# EAGLE design Solenoise (EAGLE 6.5.0)
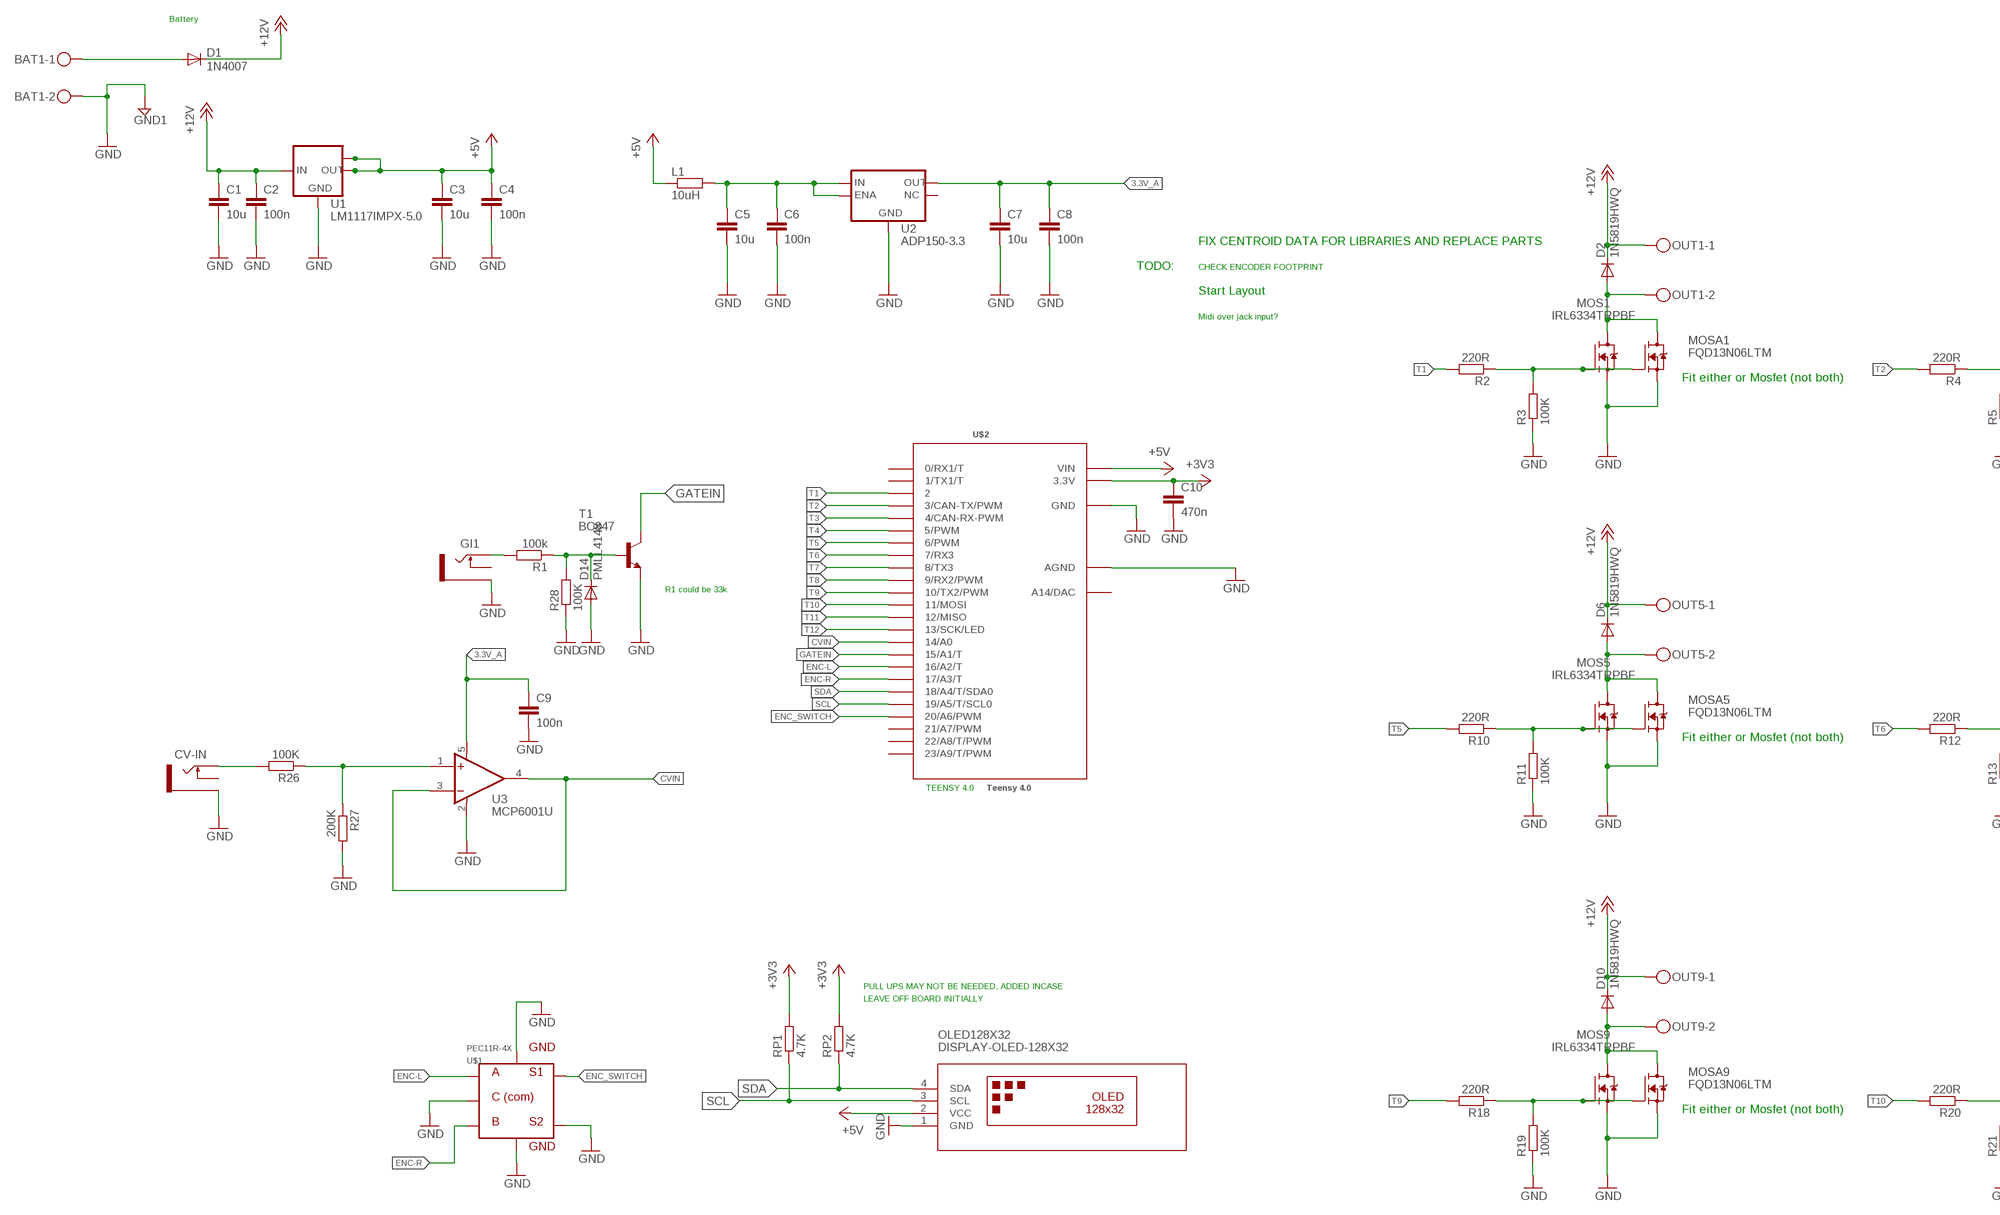
[diagram p0: schematic, sheet 1, part 1 of 2]
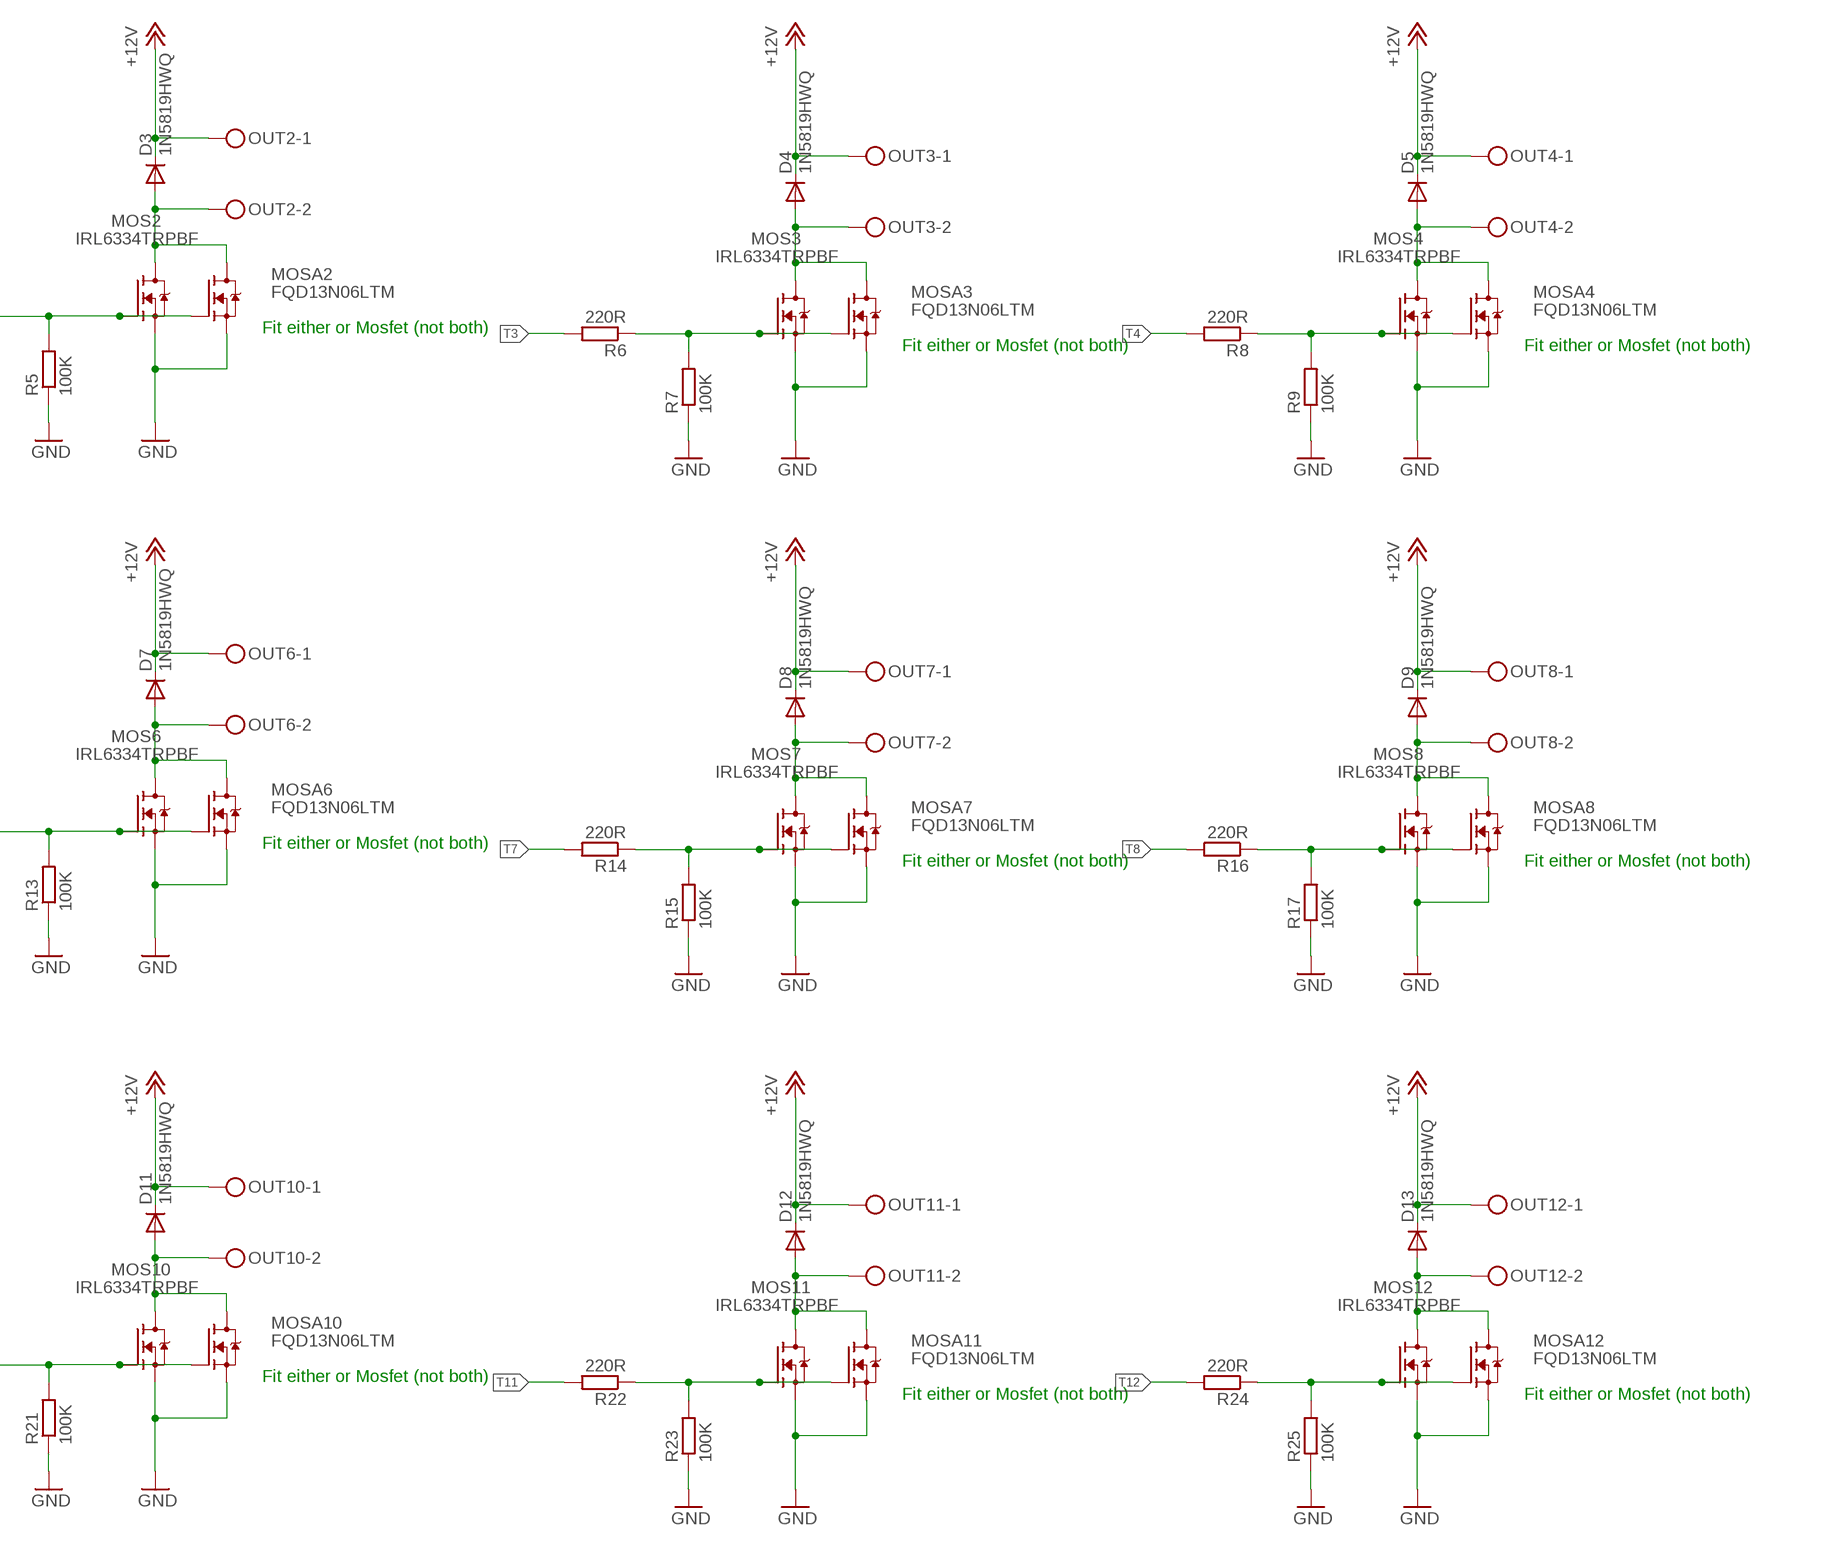
[diagram p1: schematic, sheet 1, part 2 of 2]

## Parts
BAT1  MKDSN1,5/2-5,08  [MKDSN1,5/2-5,08]
C1  10u  C-EUC1206  [C1206]
C2  100n  C-EUC0805  [C0805]
C3  10u  C-EUC1206  [C1206]
C4  100n  C-EUC0805  [C0805]
C5  10u  C-EUC1206  [C1206]
C6  100n  C-EUC0805  [C0805]
C7  10u  C-EUC1206  [C1206]
C8  100n  C-EUC0805  [C0805]
C9  100n  C-EUC0805  [C0805]
C10  470n  C-EUC0805  [C0805]
CV-IN  THONKICONNNEW  [WQP-PJ301M-12_JACK]
D1  1N4007  1N4004  [DO41-10]
D2  1N5819HWQ  MBR0520LT  [SOD123]
D3  1N5819HWQ  MBR0520LT  [SOD123]
D4  1N5819HWQ  MBR0520LT  [SOD123]
D5  1N5819HWQ  MBR0520LT  [SOD123]
D6  1N5819HWQ  MBR0520LT  [SOD123]
D7  1N5819HWQ  MBR0520LT  [SOD123]
D8  1N5819HWQ  MBR0520LT  [SOD123]
D9  1N5819HWQ  MBR0520LT  [SOD123]
D10  1N5819HWQ  MBR0520LT  [SOD123]
D11  1N5819HWQ  MBR0520LT  [SOD123]
D12  1N5819HWQ  MBR0520LT  [SOD123]
D13  1N5819HWQ  MBR0520LT  [SOD123]
D14  PMLL4148  PMLL4150  [SOD80C]
GI1  THONKICONNNEW  [WQP-PJ301M-12_JACK]
L1  10uH  R-EU_R0805  [R0805]
MOS1  IRL6334TRPBF  [IRL6344TRPBF]
MOS2  IRL6334TRPBF  [IRL6344TRPBF]
MOS3  IRL6334TRPBF  [IRL6344TRPBF]
MOS4  IRL6334TRPBF  [IRL6344TRPBF]
MOS5  IRL6334TRPBF  [IRL6344TRPBF]
MOS6  IRL6334TRPBF  [IRL6344TRPBF]
MOS7  IRL6334TRPBF  [IRL6344TRPBF]
MOS8  IRL6334TRPBF  [IRL6344TRPBF]
MOS9  IRL6334TRPBF  [IRL6344TRPBF]
MOS10  IRL6334TRPBF  [IRL6344TRPBF]
MOS11  IRL6334TRPBF  [IRL6344TRPBF]
MOS12  IRL6334TRPBF  [IRL6344TRPBF]
MOSA1  FQD13N06LTM  [FQD13N06LTM]
MOSA2  FQD13N06LTM  [FQD13N06LTM]
MOSA3  FQD13N06LTM  [FQD13N06LTM]
MOSA4  FQD13N06LTM  [FQD13N06LTM]
MOSA5  FQD13N06LTM  [FQD13N06LTM]
MOSA6  FQD13N06LTM  [FQD13N06LTM]
MOSA7  FQD13N06LTM  [FQD13N06LTM]
MOSA8  FQD13N06LTM  [FQD13N06LTM]
MOSA9  FQD13N06LTM  [FQD13N06LTM]
MOSA10  FQD13N06LTM  [FQD13N06LTM]
MOSA11  FQD13N06LTM  [FQD13N06LTM]
MOSA12  FQD13N06LTM  [FQD13N06LTM]
OLED128X32  DISPLAY-OLED-128X32  [DISPLAY-OLED-128X32]
OUT1  MKDSN1,5/2-5,08  [MKDSN1,5/2-5,08]
OUT2  MKDSN1,5/2-5,08  [MKDSN1,5/2-5,08]
OUT3  MKDSN1,5/2-5,08  [MKDSN1,5/2-5,08]
OUT4  MKDSN1,5/2-5,08  [MKDSN1,5/2-5,08]
OUT5  MKDSN1,5/2-5,08  [MKDSN1,5/2-5,08]
OUT6  MKDSN1,5/2-5,08  [MKDSN1,5/2-5,08]
OUT7  MKDSN1,5/2-5,08  [MKDSN1,5/2-5,08]
OUT8  MKDSN1,5/2-5,08  [MKDSN1,5/2-5,08]
OUT9  MKDSN1,5/2-5,08  [MKDSN1,5/2-5,08]
OUT10  MKDSN1,5/2-5,08  [MKDSN1,5/2-5,08]
OUT11  MKDSN1,5/2-5,08  [MKDSN1,5/2-5,08]
OUT12  MKDSN1,5/2-5,08  [MKDSN1,5/2-5,08]
R1  100k  R-EU_R0805  [R0805]
R2  220R  R-EU_R0805  [R0805]
R3  100K  R-EU_R0805  [R0805]
R4  220R  R-EU_R0805  [R0805]
R5  100K  R-EU_R0805  [R0805]
R6  220R  R-EU_R0805  [R0805]
R7  100K  R-EU_R0805  [R0805]
R8  220R  R-EU_R0805  [R0805]
R9  100K  R-EU_R0805  [R0805]
R10  220R  R-EU_R0805  [R0805]
R11  100K  R-EU_R0805  [R0805]
R12  220R  R-EU_R0805  [R0805]
R13  100K  R-EU_R0805  [R0805]
R14  220R  R-EU_R0805  [R0805]
R15  100K  R-EU_R0805  [R0805]
R16  220R  R-EU_R0805  [R0805]
R17  100K  R-EU_R0805  [R0805]
R18  220R  R-EU_R0805  [R0805]
R19  100K  R-EU_R0805  [R0805]
R20  220R  R-EU_R0805  [R0805]
R21  100K  R-EU_R0805  [R0805]
R22  220R  R-EU_R0805  [R0805]
R23  100K  R-EU_R0805  [R0805]
R24  220R  R-EU_R0805  [R0805]
R25  100K  R-EU_R0805  [R0805]
R26  100K  R-EU_R0805  [R0805]
R27  200K  R-EU_R0805  [R0805]
R28  100K  R-EU_R0805  [R0805]
RP1  4.7K  R-EU_R0805  [R0805]
RP2  4.7K  R-EU_R0805  [R0805]
T1  BC847  [SOT23]
U1  LM1117IMPX-5.0  [SOT223]
U2  ADP150-3.3  [SOT23-5]
U3  MCP6001U  [MCP6001]
U$1  PEC11R-4X  [ENC]
U$2  Teensy 4.0  TEENSY_3.1_DAC  [TEENSY_3.1_DAC]

## Nets
3.3V_A: C7.1 C8.1 C9.1 U2.OUT(VOUT) U3.5(V+)
+3V3: C10.1 RP1.2 RP2.2 U$2.3.3V
+5V: C3.1 C4.1 L1.1 OLED128X32.2(VCC) U1.2(OUT) U1.TAB(OUT1) U$2.VIN
+12V: C1.1 C2.1 D1.C D2.C D3.C D4.C D5.C D6.C D7.C D8.C D9.C D10.C D11.C D12.C D13.C OUT1.1 OUT2.1 OUT3.1 OUT4.1 OUT5.1 OUT6.1 OUT7.1 OUT8.1 OUT9.1 OUT10.1 OUT11.1 OUT12.1 U1.3(IN)
CVIN: U3.3(-IN) U3.4(OUT) U$2.14/A0
ENC-L: U$1.A U$2.16/A2(16/A2/T)
ENC-R: U$1.B U$2.17/A3(17/A3/T)
ENC_SWITCH: U$1.1(SW1) U$2.20/A6(20/A6/PWM)
GATEIN: T1.3(C) U$2.15/A1(15/A1/T)
GND: BAT1.2 C1.2 C2.2 C3.2 C4.2 C5.2 C6.2 C7.2 C8.2 C9.2 C10.2 CV-IN.P$3_SLEEVE(SLEEVE) D14.A GI1.P$3_SLEEVE(SLEEVE) MOS1.2(S) MOS2.2(S) MOS3.2(S) MOS4.2(S) MOS5.2(S) MOS6.2(S) MOS7.2(S) MOS8.2(S) MOS9.2(S) MOS10.2(S) MOS11.2(S) MOS12.2(S) MOSA1.2(S) MOSA2.2(S) MOSA3.2(S) MOSA4.2(S) MOSA5.2(S) MOSA6.2(S) MOSA7.2(S) MOSA8.2(S) MOSA9.2(S) MOSA10.2(S) MOSA11.2(S) MOSA12.2(S) OLED128X32.1(GND) R3.1 R5.1 R7.1 R9.1 R11.1 R13.1 R15.1 R17.1 R19.1 R21.1 R23.1 R25.1 R27.2 R28.1 T1.2(E) U1.1(GND) U2.GND U3.2(V-) U$1.2(SW2) U$1.C U$1.GND1 U$1.GND2 U$2.AGND U$2.GND ; supply symbol labelled GND1
MOS1.1: D2.A MOS1.3(D) MOSA1.3(D) OUT1.2
MOS1.2: D3.A MOS2.3(D) MOSA2.3(D) OUT2.2
MOS1.3: D4.A MOS3.3(D) MOSA3.3(D) OUT3.2
MOS1.4: D5.A MOS4.3(D) MOSA4.3(D) OUT4.2
MOS1.5: D6.A MOS5.3(D) MOSA5.3(D) OUT5.2
MOS1.6: D7.A MOS6.3(D) MOSA6.3(D) OUT6.2
MOS1.7: D8.A MOS7.3(D) MOSA7.3(D) OUT7.2
MOS1.8: D9.A MOS8.3(D) MOSA8.3(D) OUT8.2
MOS1.9: D10.A MOS9.3(D) MOSA9.3(D) OUT9.2
MOS1.10: D11.A MOS10.3(D) MOSA10.3(D) OUT10.2
MOS1.11: D12.A MOS11.3(D) MOSA11.3(D) OUT11.2
MOS1.12: D13.A MOS12.3(D) MOSA12.3(D) OUT12.2
N$1: R26.1 R27.1 U3.1(+IN)
N$2: MOS1.1(G) MOSA1.1(G) R2.1 R3.2
N$3: MOS2.1(G) MOSA2.1(G) R4.1 R5.2
N$4: MOS3.1(G) MOSA3.1(G) R6.1 R7.2
N$5: CV-IN.P$1_TIP(TIP) R26.2
N$6: C5.1 C6.1 L1.2 U2.EN(ENA) U2.VIN(IN)
N$7: MOS4.1(G) MOSA4.1(G) R8.1 R9.2
N$8: MOS5.1(G) MOSA5.1(G) R10.1 R11.2
N$9: MOS6.1(G) MOSA6.1(G) R12.1 R13.2
N$10: MOS7.1(G) MOSA7.1(G) R14.1 R15.2
N$11: MOS8.1(G) MOSA8.1(G) R16.1 R17.2
N$12: MOS9.1(G) MOSA9.1(G) R18.1 R19.2
N$13: MOS10.1(G) MOSA10.1(G) R20.1 R21.2
N$14: MOS11.1(G) MOSA11.1(G) R22.1 R23.2
N$15: MOS12.1(G) MOSA12.1(G) R24.1 R25.2
N$18: BAT1.1 D1.A
N$20: GI1.P$1_TIP(TIP) R1.2
N$21: D14.C R1.1 R28.2 T1.1(B)
SCL: OLED128X32.3(SCL) RP1.1 U$2.19/A5(19/A5/T/SCL0)
SDA: OLED128X32.4(SDA) RP2.1 U$2.18/A4(18/A4/T/SDA0)
T1: R2.2 U$2.2
T2: R4.2 U$2.3(3/CAN-TX/PWM)
T3: R6.2 U$2.4(4/CAN-RX-PWM)
T4: R8.2 U$2.5(5/PWM)
T5: R10.2 U$2.6(6/PWM)
T6: R12.2 U$2.7(7/RX3)
T7: R14.2 U$2.8(8/TX3)
T8: R16.2 U$2.9(9/RX2/PWM)
T9: R18.2 U$2.10(10/TX2/PWM)
T10: R20.2 U$2.11(11/MOSI)
T11: R22.2 U$2.12(12/MISO)
T12: R24.2 U$2.13(13/SCK/LED)
Unconnected: CV-IN.P$2_SWITCH(SWITCH) GI1.P$2_SWITCH(SWITCH) U2.NC U$2.0(0/RX1/T) U$2.1(1/TX1/T) U$2.21/A7(21/A7/PWM) U$2.22/A8(22/A8/T/PWM) U$2.23/A9(23/A9/T/PWM) U$2.RESET/DAC(A14/DAC)

## Notes on the sheet
- Battery
- FIX CENTROID DATA FOR LIBRARIES AND REPLACE PARTS
- TODO: | CHECK ENCODER FOOTPRINT
- Start Layout
- Midi over jack input?
- Fit either or Mosfet (not both) | Fit either or Mosfet (not both)
- Fit either or Mosfet (not both) | Fit either or Mosfet (not both)
- R1 could be 33k
- Fit either or Mosfet (not both) | Fit either or Mosfet (not both)
- Fit either or Mosfet (not both) | Fit either or Mosfet (not both)
- TEENSY 4.0
- PULL UPS MAY NOT BE NEEDED, ADDED INCASE
- LEAVE OFF BOARD INITIALLY
- Fit either or Mosfet (not both) | Fit either or Mosfet (not both)
- Fit either or Mosfet (not both) | Fit either or Mosfet (not both)

## Library data of the parts
BAT1 OUT1-OUT12 = con-phoenix-508:MKDSN1,5/2-5,08: MKDSN 1,5/ 2-5,08 Printklemme Nennstrom: 13,5 A Nennspannung: 250 V Rastermaß: 5,08 mm Polzahl: 2 Anschlussart: Schraubanschluss Montage: Löten Anschlussrichtung Leiter/Platine: 0 ° Artikelnummer: 1729128 Source: http://eshop.phoenixcontact.com .. 1729128.pdf; MPN: MKDSN 1,5/2-5.08; OC_FARNELL: 1792903; OC_NEWARK: 30M2397
C1-C10 = rcl:C-EU: CAPACITOR, European symbol
CV-IN GI1 = MusicThingModular:THONKICONN: 3.5mm socket for Eurorack modular synths
D1 = diode:1N4004: DIODE general purpose rectifier, 1 A
D2-D13 = diode:MBR0520LT: SCHOTTKY BARRIER RECTIFIER Source: http://onsemi.com .. MBR0520LT1-D.pdf
D14 = diode:PMLL4150: DIODE high speed
L1 R1-R28 RP1 RP2 = rcl:R-EU_: RESISTOR, European symbol
MOS1-MOS12 = IRLML6344TRPbF:IRL6334TRPBF
MOSA1-MOSA12 = FQD13N06LTM:FQD13N06LTM
OLED128X32 = OLED:DISPLAY-OLED-128X32: 128x32 Dot Matrix OLED Module with I2C interface based on SSD1306 chip More details available here: http://www.tinyosshop.com/index.php?route=product/product&product_id=953 Schematic available here: http://www.tinyosshop.com/datasheet/OLED%2012832.pdf SSD1306 datasheet: https://cdn-shop.adafruit.com/datasheets/SSD1306.pdf Click here to find device on ebay.com <http://www.ebay.com/sch/oled+display+128x32+i2c>
T1 = transistor-neu-to92:BC847: NPN TRANSISTOR
U1 = lm1117:LM1117IMPX-*
U2 = ADP150-3.3:ADP150-3.3
U3 = MCP6001:MCP6001*: MCP6001 Opamp Rail-to-rail. Note: U and R Variants have differing pin connections from the standard MCP6001
U$1 = Bourns-PEC11R-Encoder:PEC11R-4X
U$2 = Teensy_3.1_DAC:TEENSY_3.1_DAC

## Board
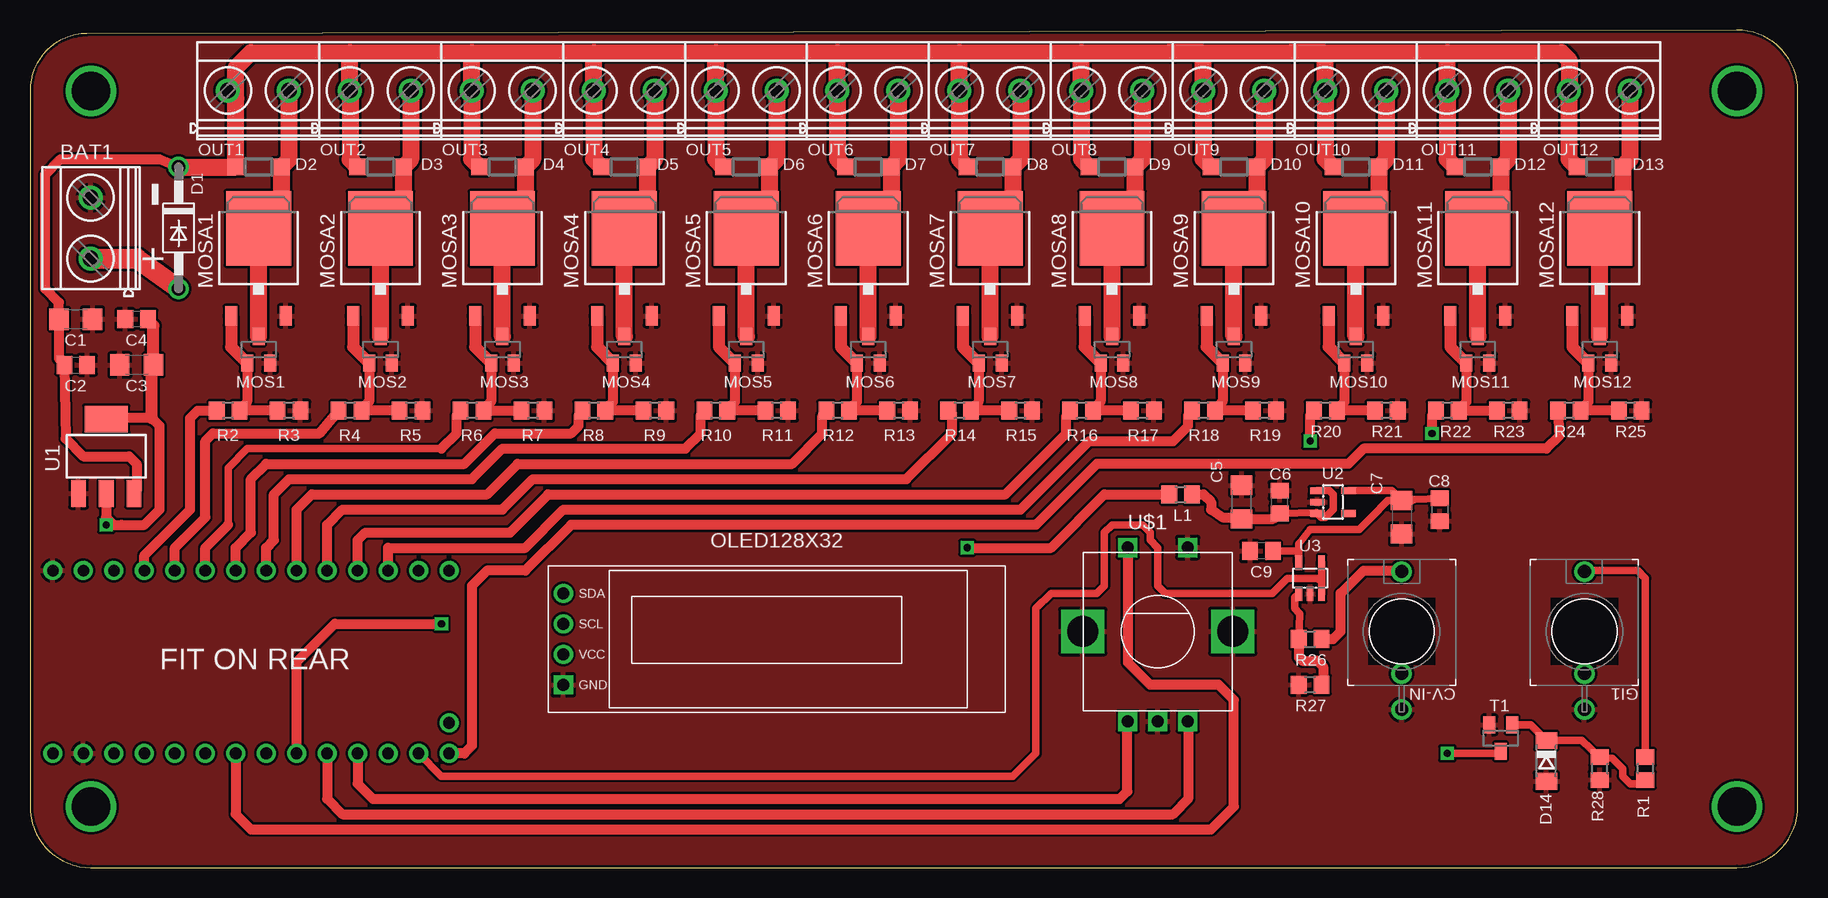
[diagram p2: board, top side]
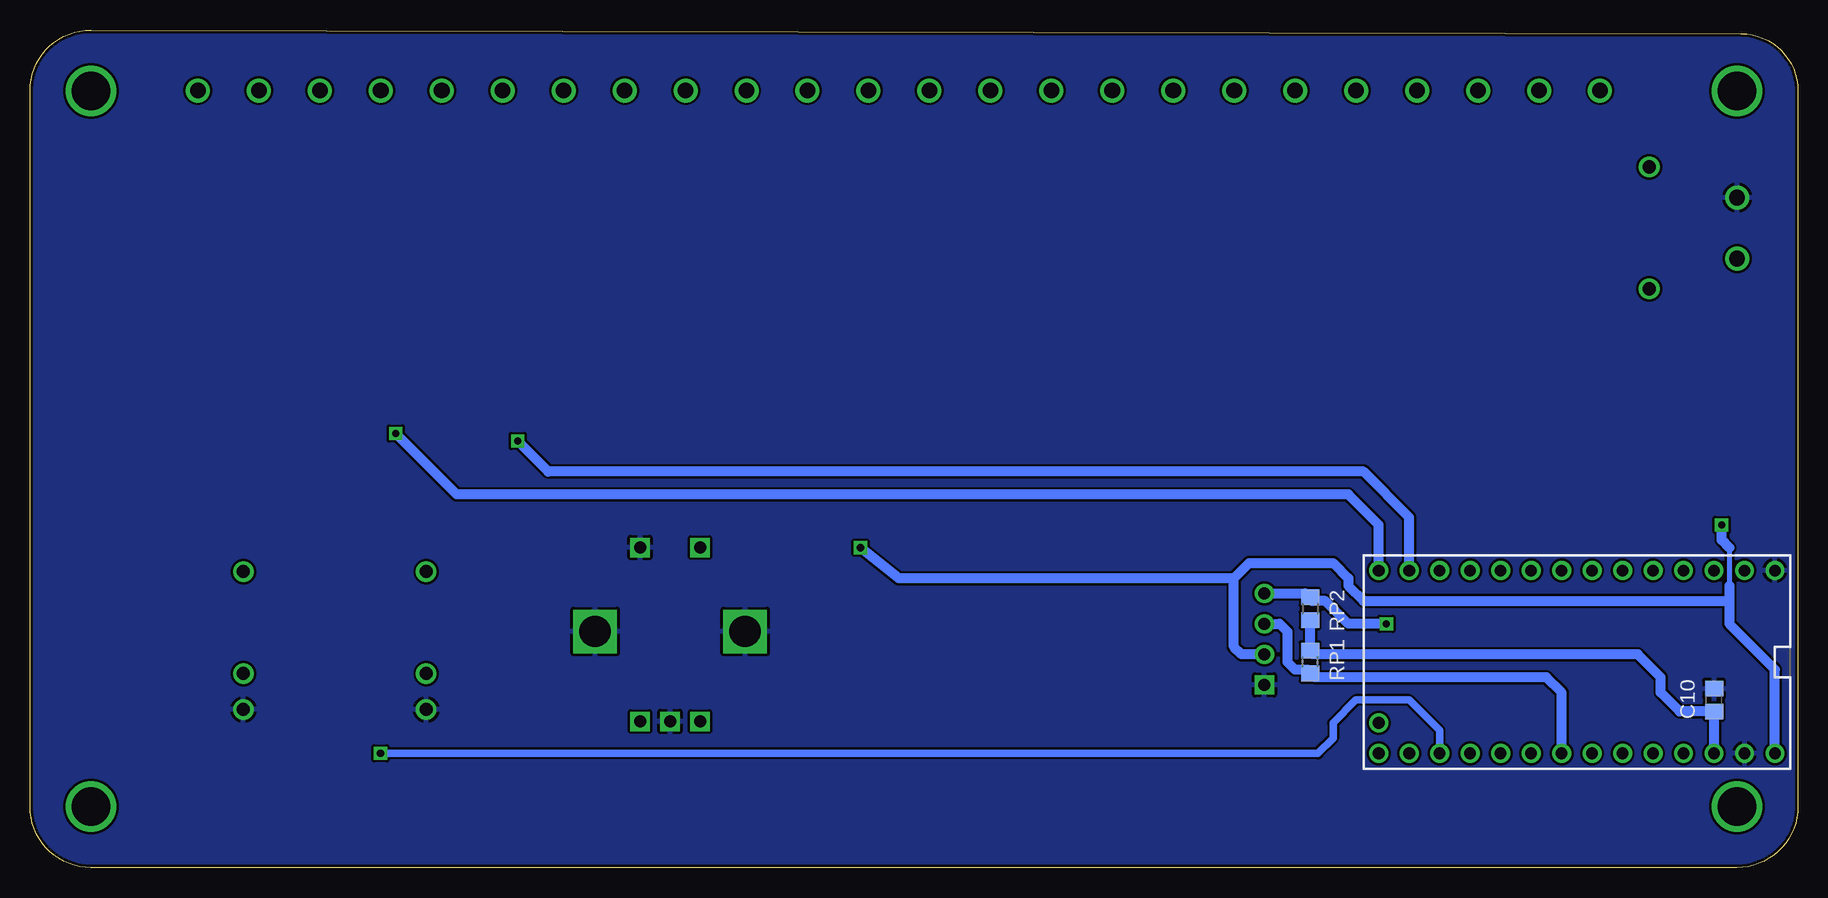
[diagram p3: board, bottom side, seen from below]

Size 147.32 x 69.84 mm. Coordinates in mm from the lower left corner, seen from the top.
Outline: 0,64.78 0,5.08 arc90 5.08,0 142.24,0 arc90 147.32,5.08 147.32,64.76 arc90 142.23,69.84 4.74,69.53 arc90 0,64.78
Copper layers (1*16): Top 0.035mm / dielectric 1.5mm / Bottom 0.035mm
Design rules "SparkFun": minimum track width 8mil, minimum drill 20mil, track to track 8mil, track to pad 8mil, pad to pad 8mil, via to via 8mil, smd to smd 8mil, copper to edge 10mil, drill to drill 8mil, minimum pad ring 12mil, minimum via ring 10mil, stop-mask expansion 4mil, vias tented up to drill 25mil, thermal gap 10mil

### Footprints (pad centres in the part's own frame; a part is rotated, then mirrored left to right if it is on the bottom)
MKDSN1,5/2-5,08 = drill 1.3 pad 2: 1 -2.561,0.025; 2 2.519,0.025
C1206 = smd 1.6 x 1.8: 1 -1.4,0; 2 1.4,0
C0805 = smd 1.3 x 1.5: 1 -0.95,0; 2 0.95,0
WQP-PJ301M-12_JACK = drill 1.1: P$1_TIP 0,5; P$2_SWITCH 0,-3.5; P$3_SLEEVE 0,-6.5
DO41-10 = drill 1.118: A 5.08,0; C -5.08,0
SOD123 = smd 1.4 x 1.4: A 1.9,0; C -1.9,0
SOD80C = smd 1.4 x 1.8: A 1.7,0; C -1.7,0
R0805 = smd 1.3 x 1.5: 1 -0.95,0; 2 0.95,0
IRL6344TRPBF = smd 1 x 1.4: 1 -0.95,-1.1; 2 0.95,-1.1; 3 0,1.1
FQD13N06LTM = smd 1 x 1.6: 1 -2.28,-4.8; 2 2.28,-4.8 | smd 5.4 x 6.2: 3 0,2.5
DISPLAY-OLED-128X32 = drill 1 square: 1 -17.78,-3.81 | drill 1: 2 -17.78,-1.27; 3 -17.78,1.27; 4 -17.78,3.81
SOT23 = smd 1 x 1.4: 1 -0.95,-1.1; 2 0.95,-1.1; 3 0,1.1
SOT223 = smd 1.219 x 2.235: 1 -2.311,-3.099; 2 0,-3.099; 3 2.311,-3.099 | smd 3.6 x 2.2: TAB 0,3.099
SOT23-5 = smd 0.55 x 1.2: EN 0.95,-1.3; GND 0,-1.3; NC 0.95,1.3; OUT -0.95,1.3; VIN -0.95,-1.3
MCP6001 = smd 0.55 x 1.2: 1 -0.95,-1.3; 2 0,-1.3; 3 0.95,-1.3; 4 0.95,1.3; 5 -0.95,1.3
ENC = drill 1 square: 1 -2.5,7; 2 2.5,7; A -2.5,-7.5; B 2.5,-7.5; C 0,-7.5 | drill 2.6 square: GND1 -6.25,0; GND2 6.25,0
TEENSY_3.1_DAC = drill 0.965: 0 -7.62,13.97; 1 -7.62,11.43; 2 -7.62,8.89; 3 -7.62,6.35; 3.3V 7.62,11.43; 4 -7.62,3.81; 5 -7.62,1.27; 6 -7.62,-1.27; 7 -7.62,-3.81; 8 -7.62,-6.35; 9 -7.62,-8.89; 10 -7.62,-11.43; 11 -7.62,-13.97; 12 -7.62,-16.51; 13 7.62,-16.51; 14/A0 7.62,-13.97; 15/A1 7.62,-11.43; 16/A2 7.62,-8.89; 17/A3 7.62,-6.35; 18/A4 7.62,-3.81; 19/A5 7.62,-1.27; 20/A6 7.62,1.27; 21/A7 7.62,3.81; 22/A8 7.62,6.35; 23/A9 7.62,8.89; AGND 7.62,13.97; GND -7.62,16.51; RESET/DAC 5.08,-16.51; VIN 7.62,16.51

### Placement (x,y rotation side)
BAT1  5.08,53.34 90 top
C1  3.81,45.72 0 top
C2  3.81,41.91 0 top
C3  8.89,41.91 180 top
C4  8.89,45.72 180 top
C5  100.97,30.48 90 top
C6  104.14,30.48 90 top
C7  114.3,29.21 270 top
C8  117.47,29.84 270 top
C9  102.62,26.4 180 top
C10  6.99,13.97 90 bottom
CV-IN  114.3,19.68 0 top
D1  12.38,53.34 270 top
D2  19.05,58.42 0 top
D3  29.21,58.42 0 top
D4  39.37,58.42 0 top
D5  49.53,58.42 0 top
D6  59.69,58.42 0 top
D7  69.85,58.42 0 top
D8  80.01,58.42 0 top
D9  90.17,58.42 0 top
D10  100.33,58.42 0 top
D11  110.49,58.42 0 top
D12  120.65,58.42 0 top
D13  130.81,58.42 0 top
D14  126.36,8.89 270 top
GI1  129.54,19.68 0 top
L1  95.89,31.11 0 top
MOS1  19.05,43.18 0 top
MOS2  29.21,43.18 0 top
MOS3  39.37,43.18 0 top
MOS4  49.53,43.18 0 top
MOS5  59.69,43.18 0 top
MOS6  69.85,43.18 0 top
MOS7  80.01,43.18 0 top
MOS8  90.17,43.18 0 top
MOS9  100.33,43.18 0 top
MOS10  110.49,43.18 0 top
MOS11  120.65,43.18 0 top
MOS12  130.81,43.18 0 top
MOSA1  19.05,50.8 0 top
MOSA2  29.21,50.8 0 top
MOSA3  39.37,50.8 0 top
MOSA4  49.53,50.8 0 top
MOSA5  59.69,50.8 0 top
MOSA6  69.85,50.8 0 top
MOSA7  80.01,50.8 0 top
MOSA8  90.17,50.8 0 top
MOSA9  100.33,50.8 0 top
MOSA10  110.49,50.8 0 top
MOSA11  120.65,50.8 0 top
MOSA12  130.81,50.8 0 top
OLED128X32  62.23,19.05 0 top
OUT1  19.05,64.77 0 top
OUT2  29.21,64.77 0 top
OUT3  39.37,64.77 0 top
OUT4  49.53,64.77 0 top
OUT5  59.69,64.77 0 top
OUT6  69.85,64.77 0 top
OUT7  80.01,64.77 0 top
OUT8  90.17,64.77 0 top
OUT9  100.33,64.77 0 top
OUT10  110.49,64.77 0 top
OUT11  120.65,64.77 0 top
OUT12  130.81,64.77 0 top
R1  134.62,8.26 90 top
R2  16.51,38.1 180 top
R3  21.59,38.1 180 top
R4  26.67,38.1 180 top
R5  31.75,38.1 180 top
R6  36.83,38.1 180 top
R7  41.91,38.1 180 top
R8  46.99,38.1 180 top
R9  52.07,38.1 180 top
R10  57.15,38.1 180 top
R11  62.23,38.1 180 top
R12  67.31,38.1 180 top
R13  72.39,38.1 180 top
R14  77.47,38.1 180 top
R15  82.55,38.1 180 top
R16  87.63,38.1 180 top
R17  92.71,38.1 180 top
R18  97.79,38.1 180 top
R19  102.87,38.1 180 top
R20  107.95,38.1 180 top
R21  113.03,38.1 180 top
R22  118.11,38.1 180 top
R23  123.19,38.1 180 top
R24  128.27,38.1 180 top
R25  133.35,38.1 180 top
R26  106.68,19.05 0 top
R27  106.68,15.24 180 top
R28  130.81,8.26 90 top
RP1  40.64,17.14 90 bottom
RP2  40.64,21.59 270 bottom
T1  122.56,10.79 180 top
U1  6.35,34.29 0 top
U2  108.58,30.48 270 top
U3  106.68,24.13 0 top
U$1  93.98,19.68 0 top
U$2  18.41,17.14 270 bottom

### Tracks (layer width: path | path; a pad name or v marks a point on that pad's centre or on a via)
3.3V_A
  Top 0.61: C9.1 105.7,26.4 U3.5 105.73,26.99 106.68,28.19 110.76,28.19 111.76,29.21 113.16,30.61 C7.1 | C7.1 114.81,30.48 115.34,30.7 C8.1 | U2.OUT 113.48,31.43 C7.1
+3V3
  Bottom 0.813: U$2.3.3V C10.1 9.85,13.02 11.43,14.61 11.43,15.88 13.34,17.78 40.42,17.78 RP1.2 RP2.2
+5V  (via drill 0.6)
  Top 0.813: U1.2 6.35,29.21 6.99,28.57 | 6.99,28.57 7.62,28.57 9.53,28.57 10.79,29.84 10.79,36.83 10.16,37.47 6.43,37.47 U1.TAB | v6.35,28.57 6.99,28.57 | v78.11,26.67 85.09,26.67 89.53,31.11 L1.1
  Top 1.016: 10.16,37.47 10.16,41.78 C3.1 10.29,45.17 C4.1
  Bottom 0.406: 5.71,26.67 5.71,23.5
  Bottom 0.813: U$2.VIN 1.91,16.51 5.71,20.32 5.71,22.23 | OLED128X32.2 46.35,17.78 46.99,18.41 46.99,24.13 | 46.99,24.13 45.72,25.4 38.73,25.4 37.47,24.13 37.47,23.5 36.2,22.23 5.71,22.23 | 46.99,24.13 74.93,24.13 v78.11,26.67 | 5.71,23.5 5.71,22.23 | 5.71,26.67 6.35,27.3 v6.35,28.57
+12V
  Top 0.813: D1.C 10.79,59.05 2.54,59.05 1.27,57.78 1.27,48.26 2.41,47.12 C1.1 2.41,42.46 C2.1 2.96,35.77 4.45,34.29 8.26,34.29 8.89,33.66 8.89,31.42 U1.3
  Top 1.422: D1.C D2.C 17.15,64.13 | 17.15,64.13 OUT1.1 | 17.15,64.13 17.15,66.68 18.41,67.94 26.67,67.94 | 26.67,67.94 36.83,67.94 | 36.83,67.94 46.99,67.94 | 46.99,67.94 57.15,67.94 | 57.15,67.94 67.31,67.94 | 67.31,67.94 77.47,67.94 | 77.47,67.94 87.63,67.94 | 87.63,67.94 94.93,67.94 | 94.93,67.94 105.09,67.94 | 105.09,67.94 118.11,67.94 | 118.11,67.94 127.64,67.94 128.27,67.31 128.27,64.82 OUT12.1 128.25,59.08 D13.C | 26.67,67.94 26.65,67.92 OUT2.1 26.67,64.77 26.67,59.06 D3.C | 36.83,67.94 36.81,67.92 OUT3.1 36.81,59.08 D4.C | 46.99,67.94 46.97,67.92 OUT4.1 46.97,59.08 D5.C | 57.15,67.94 57.13,67.92 OUT5.1 57.13,59.08 D6.C | 67.31,67.94 67.31,67.31 67.29,67.29 OUT6.1 67.29,59.08 D7.C | 77.47,67.94 77.45,67.92 OUT7.1 77.45,59.08 D8.C | 87.63,67.94 87.61,67.92 OUT8.1 87.61,59.08 D9.C | 94.93,67.94 97.77,67.92 OUT9.1 97.77,59.08 D10.C | 105.09,67.94 107.93,67.92 OUT10.1 107.93,59.08 D11.C | 118.11,67.94 118.09,67.92 OUT11.1 118.09,59.08 D12.C
CVIN
  Top 0.61: U3.4 U3.3 107.63,23.82 107.31,24.13 104.78,24.13 103.5,22.86 94.61,22.86 93.98,23.5 93.98,26.67 93.34,27.3 93.34,27.94 92.71,28.57 90.17,28.57 89.53,27.94 89.53,23.5 88.9,22.86 85.09,22.86 83.82,21.59 83.82,9.53 81.92,7.62 34.29,7.62 U$2.14/A0
ENC-L
  Top 0.813: U$2.16/A2 27.3,6.99 28.57,5.71 90.81,5.71 91.44,6.35 91.44,12.14 U$1.A
ENC-R
  Top 0.813: U$2.17/A3 24.77,5.71 26.04,4.45 95.25,4.45 96.52,5.71 96.52,12.14 U$1.B
ENC_SWITCH
  Top 0.813: U$2.20/A6 17.14,4.45 18.41,3.17 98.42,3.17 100.33,5.08 100.33,13.97 99.06,15.24 93.34,15.24 91.48,17.11 U$1.1
GATEIN  (via drill 0.6)
  Top 0.61: v118.11,9.53 122.39,9.53 T1.3
  Bottom 0.61: U$2.15/A1 29.84,11.43 32.38,13.97 36.83,13.97 38.73,12.06 38.73,10.79 40.01,9.53 v118.11,9.53
GND
  pour Top: 0,0 0,69.85 147.32,69.85 147.32,0
  pour Bottom: 0,0 0,69.85 147.32,69.85 147.32,0
MOS1.1
  Top 1.422: OUT1.2 21.57,59.04 D2.A 20.95,55.2 19.7,53.95 | 19.7,53.95 MOSA1.3 | MOS1.3 19.05,54.61 19.7,53.95
MOS1.2
  Top 1.422: OUT2.2 31.73,59.04 D3.A 31.11,55.2 MOSA2.3 MOS2.3
MOS1.3
  Top 1.422: OUT3.2 41.89,59.04 D4.A 41.27,55.2 MOSA3.3 MOS3.3
MOS1.4
  Top 1.422: OUT4.2 52.05,59.04 D5.A 51.43,55.2 MOSA4.3 MOS4.3
MOS1.5
  Top 1.422: OUT5.2 62.21,59.04 D6.A 61.59,55.24 59.05,52.7 59.09,52.7 MOSA5.3 MOS5.3
MOS1.6
  Top 1.422: OUT6.2 72.37,59.04 D7.A 71.75,55.2 MOSA6.3 MOS6.3
MOS1.7
  Top 1.422: OUT7.2 82.55,64.77 82.55,59.06 D8.A 81.91,55.2 MOSA7.3 MOS7.3
MOS1.8
  Top 1.422: OUT8.2 92.69,59.04 D9.A 92.07,55.2 MOSA8.3 MOS8.3
MOS1.9
  Top 1.422: OUT9.2 102.85,59.04 D10.A 102.23,55.2 MOSA9.3 MOS9.3
MOS1.10
  Top 1.422: OUT10.2 113.01,59.04 D11.A 112.39,55.2 MOSA10.3 MOS10.3
MOS1.11
  Top 1.422: OUT11.2 123.17,59.04 D12.A 122.55,55.2 MOSA11.3 MOS11.3
MOS1.12
  Top 1.422: OUT12.2 133.33,59.04 D13.A 132.71,55.2 MOSA12.3 MOS12.3
N$1
  Top 0.61: R26.1 105.83,21.17 105.41,21.59 105.41,22.51 U3.1
  Top 0.813: R26.1 105.73,17.52 106,17.25 107.25,17.25 107.75,16.75 107.75,15.36 R27.1
N$2
  Top 0.813: MOS1.1 18.1,38.84 R2.1 R3.2
  Top 1.016: MOSA1.1 16.77,43.41 MOS1.1
N$3
  Top 0.813: MOS2.1 28.26,38.84 R4.1 R5.2
  Top 1.016: MOSA2.1 26.93,43.41 MOS2.1
N$4
  Top 0.813: MOS3.1 38.42,38.84 R6.1 R7.2
  Top 1.016: MOSA3.1 37.09,43.41 MOS3.1
N$5
  Top 0.813: R26.2 108.58,19.05 109.22,19.68 109.22,22.86 111.12,24.77 114.22,24.77 CV-IN.P$1_TIP
N$6
  Top 0.61: C6.1 107.19,29.63 U2.EN 107.61,29.21 107.95,29.21 108.58,29.84 108.58,31.11 108.27,31.43 U2.VIN
  Top 0.813: L1.2 97.79,31.11 98.42,30.48 98.42,29.84 99.38,29.21 101.15,29.21 C5.1 103.59,29.08 C6.1
N$7
  Top 0.813: MOS4.1 48.58,38.84 R8.1 R9.2
  Top 1.016: MOSA4.1 47.25,43.41 MOS4.1
N$8
  Top 0.813: MOS5.1 58.74,38.84 R10.1 R11.2
  Top 1.016: MOSA5.1 57.41,43.41 MOS5.1
N$9
  Top 0.813: MOS6.1 68.9,38.84 R12.1 R13.2
  Top 1.016: MOSA6.1 67.57,43.41 MOS6.1
N$10
  Top 0.813: MOS7.1 79.06,38.84 R14.1 R15.2
  Top 1.016: MOSA7.1 77.73,43.41 MOS7.1
N$11
  Top 0.813: MOS8.1 89.22,38.84 R16.1 R17.2
  Top 1.016: MOSA8.1 87.89,43.41 MOS8.1
N$12
  Top 0.813: MOS9.1 99.38,38.84 R18.1 R19.2
  Top 1.016: MOSA9.1 98.05,43.41 MOS9.1
N$13
  Top 0.813: MOS10.1 109.54,38.84 R20.1 R21.2
  Top 1.016: MOSA10.1 108.21,43.41 MOS10.1
N$14
  Top 0.813: MOS11.1 119.7,38.84 R22.1 R23.2
  Top 1.016: MOSA11.1 118.37,43.41 MOS11.1
N$15
  Top 0.813: MOS12.1 129.86,38.84 R24.1 R25.2
  Top 1.016: MOSA12.1 128.53,43.41 MOS12.1
N$16  (via drill 3.2 pad 3.81)
  other vias: 5.08,64.77
N$17  (via drill 3.2 pad 3.81)
  other vias: 142.24,64.77
N$18
  Top 1.676: BAT1.1 8.91,50.78 D1.A
N$19  (via drill 3.2 pad 3.81)
  other vias: 142.24,5.08
N$20
  Top 0.61: R1.2 134.62,24.13 133.99,24.77 129.62,24.77 GI1.P$1_TIP
N$21
  Top 0.61: T1.1 125.06,11.89 D14.C 129.32,10.59 R28.2 131.87,9.11 132.72,8.26 132.72,7.62 133.35,6.99 134.2,6.99 R1.1
N$22  (via drill 3.2 pad 3.81)
  other vias: 5.08,5.08
SCL
  Bottom 0.813: U$2.19/A5 19.68,14.61 20.95,15.88 40.22,15.88 RP1.1 40.85,16.51 41.91,16.51 42.55,17.14 42.55,19.68 43.18,20.32 OLED128X32.3
SDA  (via drill 0.6)
  Top 0.813: U$2.18/A4 22.23,17.14 25.4,20.32 v34.29,20.32
  Bottom 0.813: v34.29,20.32 37.47,20.32 39.37,22.23 40.42,22.23 RP2.1 41.06,22.86 OLED128X32.4
T1
  Top 0.813: U$2.2 9.53,26.04 13.34,29.84 13.34,37.47 13.97,38.1 R2.2
T2
  Top 0.813: U$2.3 12.06,26.67 14.61,29.21 14.61,35.56 15.24,36.2 24.13,36.2 25.4,37.68 R4.2
T3
  Top 0.61: 16.51,28.57 16.51,33.34 18.1,34.92 34.29,34.92
  Top 0.813: U$2.4 14.61,26.67 16.51,28.57 | 34.29,34.92 35.56,36.2 35.56,37.68 R6.2
T4
  Top 0.813: U$2.5 17.14,26.67 18.41,27.94 18.41,32.38 19.68,33.66 36.2,33.66 38.73,36.2 45.09,36.2 45.72,36.83 45.72,37.68 R8.2
T5
  Top 0.813: U$2.6 19.68,26.67 20.32,27.3 20.32,31.11 21.59,32.38 36.83,32.38 39.37,34.92 54.61,34.92 55.88,36.2 55.88,37.68 R10.2
T6
  Top 0.813: U$2.7 22.23,29.84 23.5,31.11 38.1,31.11 40.64,33.66 63.5,33.66 66.04,36.2 66.04,37.68 R12.2
T7
  Top 0.813: U$2.8 24.77,28.57 26.04,29.84 39.37,29.84 41.91,32.38 73.03,32.38 76.83,36.2 76.83,37.88 R14.2
T8
  Top 0.813: U$2.9 27.3,27.3 27.94,27.94 40.01,27.94 43.18,31.11 81.28,31.11 86.36,36.2 86.36,37.68 R16.2
T9
  Top 0.813: U$2.10 29.84,26.67 41.27,26.67 44.45,29.84 82.55,29.84 88.27,35.56 95.25,35.56 96.52,36.83 96.52,37.68 R18.2
T10  (via drill 0.6)
  Top 0.813: v106.68,35.56 106.68,37.68 R20.2
  Bottom 0.813: U$2.11 32.38,29.21 36.2,33.02 104.14,33.02 v106.68,35.56
T11  (via drill 0.6)
  Top 0.813: v116.84,36.2 116.84,37.68 R22.2
  Bottom 0.813: U$2.12 34.92,28.57 37.47,31.11 111.76,31.11 v116.84,36.2
T12
  Top 0.813: R24.2 127.42,35.98 126.36,34.92 111.12,34.92 109.86,33.66 88.9,33.66 83.82,28.57 45.09,28.57 41.27,24.77 38.1,24.77 36.83,23.5 36.83,10.16 36.2,9.53 U$2.13

### Text on the board
tNames: - | + | FIT ON REAR